# EAGLE design main (EAGLE 6.5.0)
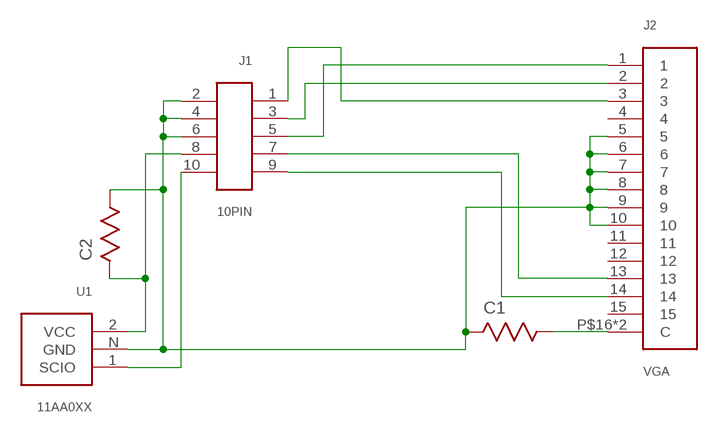
[diagram p0: schematic, sheet 1]

## Parts
C1  RESISTOR0603  [0603]
C2  RESISTOR0603  [0603]
J1  10PIN  [10PIN]
J2  VGA  [VGA]
U1  11AA0XX  [SOT-23]

## Nets
N$1: J1.5 J2.1
N$2: J1.3 J2.2
N$3: J1.1 J2.3
N$5: C1.P$2 J2.P$16(C) J2.P$17(C)
N$6: J1.7 J2.13
N$7: J1.9 J2.14
N$8: C1.P$1 C2.P$2 J1.2 J1.4 J1.6 J2.5 J2.6 J2.7 J2.8 J2.9 J2.10 U1.N(GND)
N$10: C2.P$1 J1.8 U1.2(VCC)
N$11: J1.10 U1.1(SCIO)
Unconnected: J2.4 J2.11 J2.12 J2.15

## Library data of the parts
C1 C2 = Standard:RESISTOR
J1 = Connector:10PIN
J2 = Connector:VGA
U1 = Microchip:11AA0XX

## Board
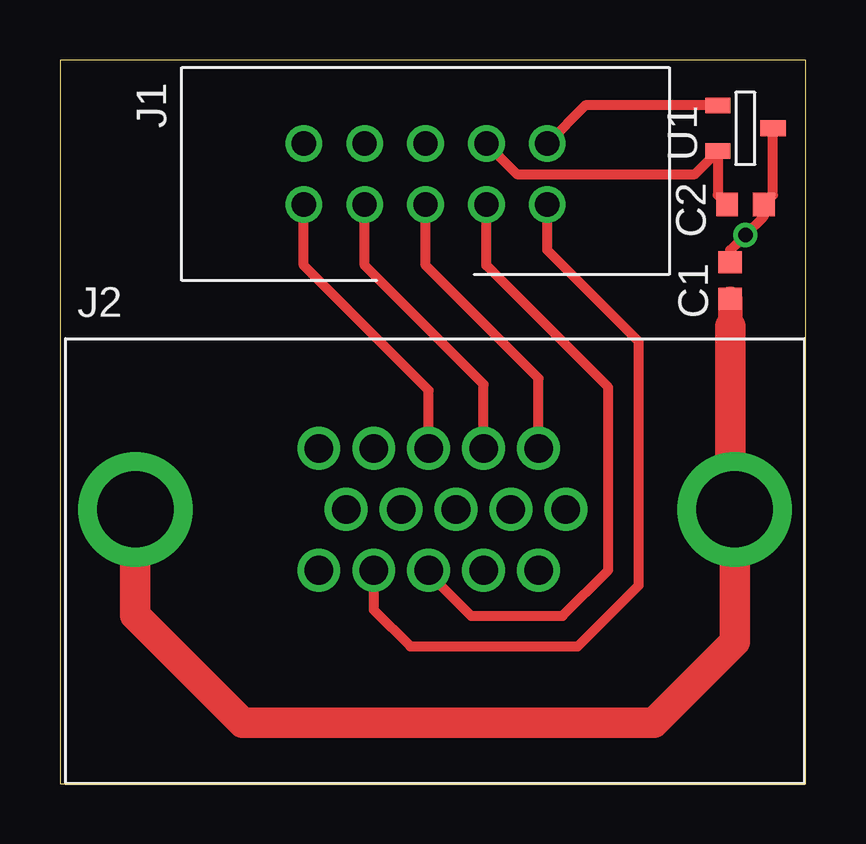
[diagram p1: board, top side]
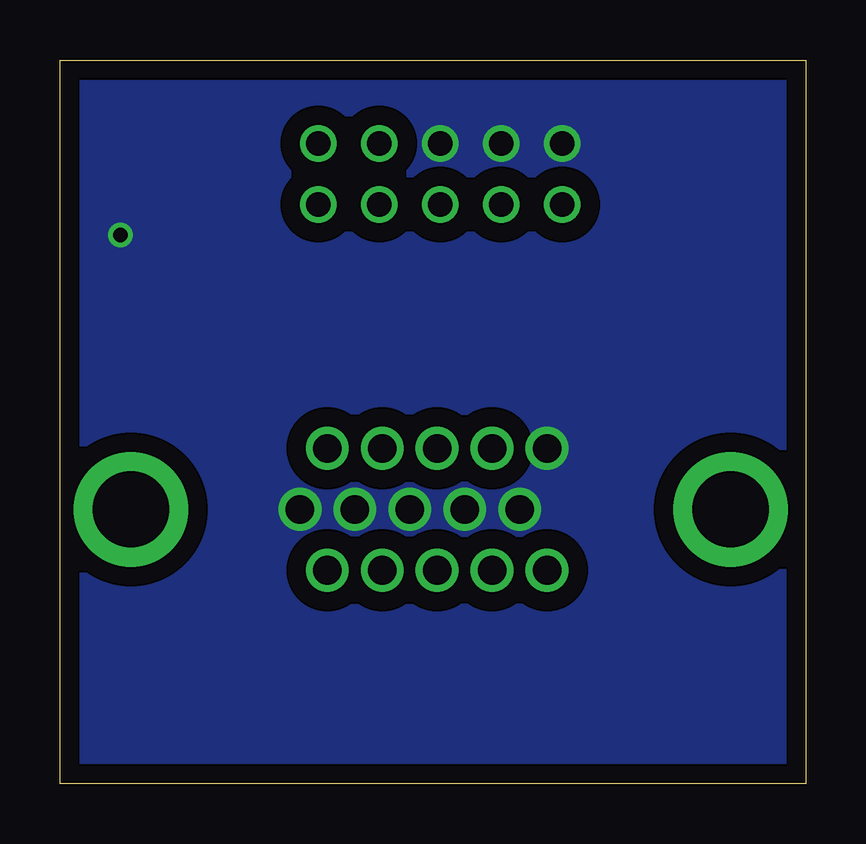
[diagram p2: board, bottom side, seen from below]

Size 31.09 x 30.15 mm. Coordinates in mm from the lower left corner, seen from the top.
Outline: 0,0 31.09,0 31.09,30.15 0,30.15 0,0
Copper layers (1*16): Top 0.0178mm / dielectric 59mil / Bottom 0.0178mm
Design rules "SSC-EAGLE-2Lyr_v1.0.0.3": minimum track width 6mil, minimum drill 14mil, track to track 6mil, track to pad 6mil, pad to pad 6mil, via to via 6mil, smd to smd 6mil, copper to edge 20mil, drill to drill 16mil, minimum pad ring 8mil, minimum via ring 8mil, stop-mask expansion 3mil, vias tented up to drill 0mil, thermal gap 10mil

### Footprints (pad centres in the part's own frame; a part is rotated, then mirrored left to right if it is on the bottom)
0603 = smd 0.914 x 0.965: P$1 -0.762,0; P$2 0.762,0
10PIN = drill 1.016: 1 -5.08,-1.27; 2 -5.08,1.27; 3 -2.54,-1.27; 4 -2.54,1.27; 5 0,-1.27; 6 0,1.27; 7 2.54,-1.27; 8 2.54,1.27; 9 5.08,-1.27; 10 5.08,1.27
VGA = drill 1.19: 1 3.44,2.54; 2 1.15,2.54; 3 -1.14,2.54; 4 -3.43,2.54; 5 -5.72,2.54; 6 4.58,0; 7 2.29,0; 8 0,0; 9 -2.29,0; 10 -4.58,0; 11 3.44,-2.54; 12 1.15,-2.54; 13 -1.14,-2.54; 14 -3.43,-2.54; 15 -5.72,-2.54 | drill 3.18: P$16 -13.37,0; P$17 11.62,0
SOT-23 = smd 0.65 x 1.05: 1 -0.95,-1.15; 2 0.95,-1.15; N 0,1.15

### Placement (x,y rotation side)
C1  27.94,20.95 270 top
C2  28.57,24.13 0 top
J1  15.24,25.4 0 top
J2  16.51,11.43 0 top
U1  28.57,27.3 270 top

### Tracks (layer width: path | path; a pad name or v marks a point on that pad's centre or on a via)
N$1
  Top 0.406: J2.1 19.95,16.88 15.24,21.59 J1.5
N$2
  Top 0.406: J2.2 17.66,16.63 12.7,21.59 J1.3
N$3
  Top 0.406: J2.3 15.37,16.38 10.16,21.59 J1.1
N$5
  Top 1.016: 27.94,19.05 C1.P$2
  Top 1.27: J2.P$16 3.14,7.02 7.62,2.54 24.77,2.54 28.13,5.91 J2.P$17 27.94,11.62 27.94,19.05
N$6
  Top 0.406: J2.13 15.37,8.76 17.14,6.99 20.95,6.99 22.86,8.89 22.86,16.51 17.78,21.59 J1.7
N$7
  Top 0.406: J2.14 13.08,7.24 14.61,5.71 21.59,5.71 24.13,8.26 24.13,18.41 20.32,22.23 J1.9
N$8  (via drill 0.6)
  Top 0.406: C1.P$1 27.94,22.23 v28.57,22.86 29.34,23.62 C2.P$2 29.73,24.52 U1.N
  pour Bottom (isolate 0.813, no thermals): 0,29.84 0,0 31.11,0 31.11,29.84
N$10
  Top 0.406: J1.8 19.05,25.4 26.47,25.4 U1.2 27.43,24.52 C2.P$1
N$11
  Top 0.406: U1.1 21.91,28.25 J1.10